# EAGLE schematic QAn_Smar_Shield_1_0 (EAGLE 6.6.0)

## Sheet 1 of 3
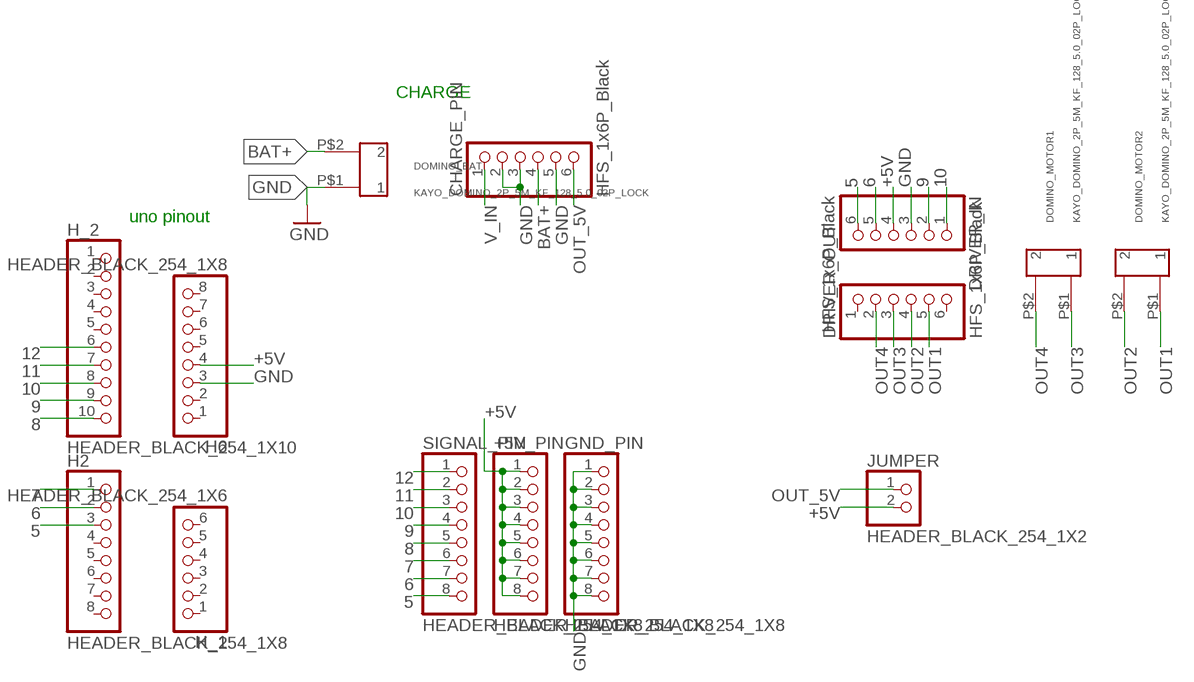
[diagram p0: schematic, sheet 1]

### Parts
+5V_PIN  HEADER_BLACK_254_1X8  KXN_HEADER_1X8_M_LOCK  [HEADER_1X8_254_LOCK]
CHARGE_PIN  HFS_1x6P_Black  KXN_HEADER_1X6_LF  [HEADER_1X6_LOCK_FEMALE]
DOMINO_BAT  KAYO_DOMINO_2P_5M_KF_128_5.0_02P_LOCK  [KF128-5.0-02P]
DOMINO_MOTOR1  KAYO_DOMINO_2P_5M_KF_128_5.0_02P_LOCK  [KF128-5.0-02P]
DOMINO_MOTOR2  KAYO_DOMINO_2P_5M_KF_128_5.0_02P_LOCK  [KF128-5.0-02P]
DRIVER_IN  HFS_1x6P_Black  KXN_HEADER_1X6_LF  [HEADER_1X6_LOCK_FEMALE]
DRIVER_OUT  HFS_1x6P_Black  KXN_HEADER_1X6_LF  [HEADER_1X6_LOCK_FEMALE]
GND_PIN  HEADER_BLACK_254_1X8  KXN_HEADER_1X8_M_LOCK  [HEADER_1X8_254_LOCK]
H2  HEADER_BLACK_254_1X8  KXN_HEADER_1X8_M_LOCK  [HEADER_1X8_254_LOCK]
H6  HEADER_BLACK_254_1X8  KXN_HEADER_1X8_M_LOCK  [HEADER_1X8_254_LOCK]
H_1  HEADER_BLACK_254_1X6  KXN_HEADER_1X6_M_LOCK  [HEADER_1X6_254_LOCK]
H_2  HEADER_BLACK_254_1X10  KXN_HEADER_1X10_M_LOCK  [HEADER_1X10_254_LOCK]
JUMPER  HEADER_BLACK_254_1X2  KXN_HEADER_1X2_LOCK  [HEADER_1X2_254_LOCK]
SIGNAL_PIN  HEADER_BLACK_254_1X8  KXN_HEADER_1X8_M_LOCK  [HEADER_1X8_254_LOCK]

### Nets
5: DRIVER_IN.6 H2.3 SIGNAL_PIN.8
6: DRIVER_IN.5 H2.2 SIGNAL_PIN.7
7: H2.1 SIGNAL_PIN.6
8: H_2.10 SIGNAL_PIN.5
9: DRIVER_IN.2 H_2.9 SIGNAL_PIN.4
10: DRIVER_IN.1 H_2.8 SIGNAL_PIN.3
11: H_2.7 SIGNAL_PIN.2
12: H_2.6 SIGNAL_PIN.1
+5V: +5V_PIN.1 +5V_PIN.2 +5V_PIN.3 +5V_PIN.4 +5V_PIN.5 +5V_PIN.6 +5V_PIN.7 +5V_PIN.8 DRIVER_IN.4 H6.4 JUMPER.2
BAT+: CHARGE_PIN.4 DOMINO_BAT.P$2
GND: CHARGE_PIN.2 CHARGE_PIN.3 CHARGE_PIN.5 DOMINO_BAT.P$1 DRIVER_IN.3 GND_PIN.1 GND_PIN.2 GND_PIN.3 GND_PIN.4 GND_PIN.5 GND_PIN.6 GND_PIN.7 GND_PIN.8 H6.3
OUT1: DOMINO_MOTOR2.P$1 DRIVER_OUT.5
OUT2: DOMINO_MOTOR2.P$2 DRIVER_OUT.4
OUT3: DOMINO_MOTOR1.P$1 DRIVER_OUT.3
OUT4: DOMINO_MOTOR1.P$2 DRIVER_OUT.2
OUT_5V: CHARGE_PIN.6 JUMPER.1
V_IN: CHARGE_PIN.1
Unconnected: DRIVER_OUT.1 DRIVER_OUT.6 H2.4 H2.5 H2.6 H2.7 H2.8 H6.1 H6.2 H6.5 H6.6 H6.7 H6.8 H_1.1 H_1.2 H_1.3 H_1.4 H_1.5 H_1.6 H_2.1 H_2.2 H_2.3 H_2.4 H_2.5

### Notes on the sheet
- CHARGE
- uno pinout

## Sheet 2 of 3
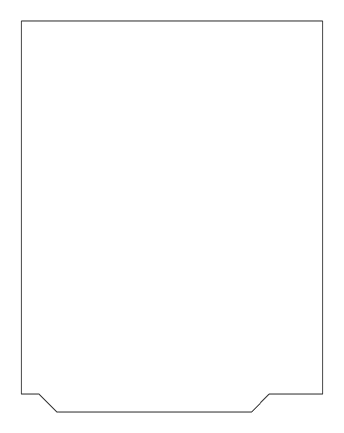
[diagram p1: schematic, sheet 2]

## Sheet 3 of 3
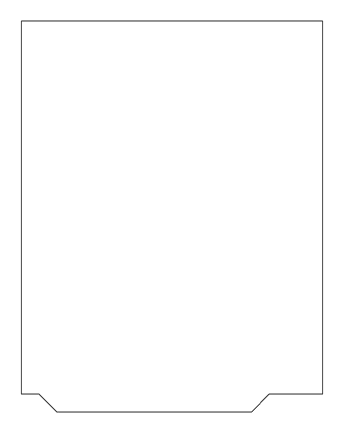
[diagram p2: schematic, sheet 3]

## Library data of the parts
+5V_PIN GND_PIN H2 H6 SIGNAL_PIN = kxnStandard_connector:KXN_HEADER_1X8; CC_SHOP: CongCo
CHARGE_PIN DRIVER_IN DRIVER_OUT = kxnStandard_connector:KXN_HEADER_1X6; CC_COST: 0.1; CC_ID: 522579376259; CC_OPTION: 1*6P单排母座; CC_SHOP: CongCo; INFO: Header Female Straight 2.54mm 1x6P 8.5mm Black; KXN_ID: SA88157764; LINK_MH: https://banlinhkien.com/jump-don-cai-2.54mm-1x6p-thang-5c-p22711163.html
DOMINO_BAT DOMINO_MOTOR1 DOMINO_MOTOR2 = kxnStandard_connector:KAYO_DOMINO_2P_5M; CC_SHOP: CongCo
H_1 = kxnStandard_connector:KXN_HEADER_1X6; CC_SHOP: CongCo
H_2 = kxnStandard_connector:KXN_HEADER_1X10; CC_SHOP: CongCo
JUMPER = kxnStandard_connector:KXN_HEADER_1X2; CC_SHOP: CongCo

## Net classes
0 default: width 0.254 mm, clearance 0.254 mm
1 power: width 0.61 mm, drill 0.61 mm, clearance 0.254 mm
2 gnd: width 0.305 mm, drill 0.559 mm, clearance 0.254 mm
3 usbvcc: width 0.508 mm, drill 0.61 mm, clearance 0.254 mm
4 aref: width 0.406 mm, drill 0.61 mm, clearance 0.254 mm